# Altium schematic sheet USB-OLED.SchDoc
size A4
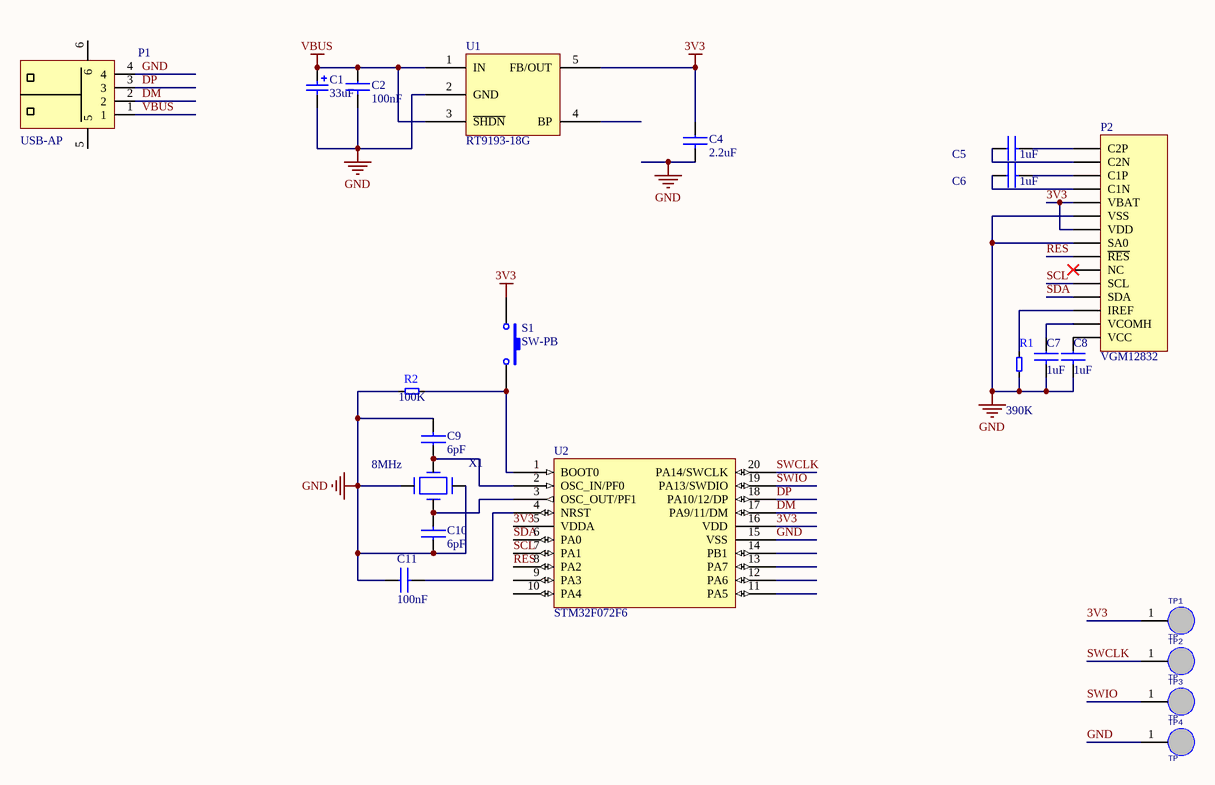
[diagram p0: USB-OLED.SchDoc]

## Parts
C1  33uF  [C1206/A]
C2  100nF  [C0603]
C4  2.2uF  [C0603]
C5  1uF  [C0603]
C6  1uF  [C0603]
C7  1uF  [C0603]
C8  1uF  [C0603]
C9  6pF  [C0603]
C10  6pF  [C0603]
C11  100nF  [C0603]
P1  USB-AP  [USB-AP-SMT]
P2  VGM12832  [VGM12832B]
R1  390K  [R0603]
R2  100K  [R0603]
S1  SW-PB  [TS-1806B]
TP1  TP  [TestPoint]
TP2  TP  [TestPoint]
TP3  TP  [TestPoint]
TP4  TP  [TestPoint]
U1  RT9193-18G  [SOT23-5]
U2  STM32F072F6  [TSSOP20]
X1  8MHz  [NX2520]

## Nets
3V3: C4.1 P2.5(VBAT) P2.7(VDD) S1.1 TP1.1 U1.5(FB/OUT) U2.5(VDDA) U2.16(VDD)
GND: C1.2 C2.2 C4.2 C7.2 C8.2 C9.2 C10.1 C11.1 P1.4 P2.6(VSS) P2.8(SA0) R1.1 R2.2 TP4.1 U1.2(GND) U2.15(VSS) X1.2 X1.4
VBUS: C1.1 C2.1 P1.1 U1.1(IN) U1.3(~{SHDN})
DM: P1.2 U2.17(PA9/11/DM)
DP: P1.3 U2.18(PA10/12/DP)
RES: P2.9(~{RES}) U2.8(PA2)
SCL: P2.11(SCL) U2.7(PA1)
SDA: P2.12(SDA) U2.6(PA0)
SWCLK: TP2.1 U2.20(PA14/SWCLK)
SWIO: TP3.1 U2.19(PA13/SWDIO)
NetC5_1: C5.1 P2.2(C2N)
NetC5_2: C5.2 P2.1(C2P)
NetC6_1: C6.1 P2.4(C1N)
NetC6_2: C6.2 P2.3(C1P)
NetC7_1: C7.1 P2.14(VCOMH)
NetC8_1: C8.1 P2.15(VCC)
NetC9_1: C9.1 U2.2(OSC_IN/PF0) X1.3
NetC10_2: C10.2 U2.3(OSC_OUT/PF1) X1.1
NetC11_2: C11.2 U2.4(NRST)
NetP2_13: P2.13(IREF) R1.2
NetR2_1: R2.1 S1.2 U2.1(BOOT0)

Not connected (* = marked no-connect by the designer): P1 5 6; P2 10(NC)*; U1 4(BP); U2 9(PA3) 10(PA4) 11(PA5) 12(PA6) 13(PA7) 14(PB1)

## Notes on the sheet
- Title
- Size:
- Date:
- A4
- Number:
- Time:
- Revision:
- Sheet
- of
- File:

## Library data of the parts
C1 = CAP1206/A: 电容
C2 C5 C6 C9-C11 = CAP: 电容; Text Field1: 20; Text Field2: 10
C4 C7 C8 = CAP0805: 电容; Text Field1: 20; Text Field2: 10
R1 R2 = RES: 电阻
S1 = SW-PB: Switch; Published: 24-Mar-1999; LatestRevisionDate: 17-Jul-2002; LatestRevisionNote: Re-released for DXP Platform.; PackageReference: SPST-2; Publisher: Altium Limited; PackageDescription: Switch; 2 Leads
TP1-TP4 = TP: 测试点; Part Field 1: 20; Part Field 2: 20
U1 = RT9193: 芯片; Text Field1: 70; Text Field2: 60
X1 = CRYSTAL4: 晶振